# EAGLE design VNP (EAGLE 9.6.2)
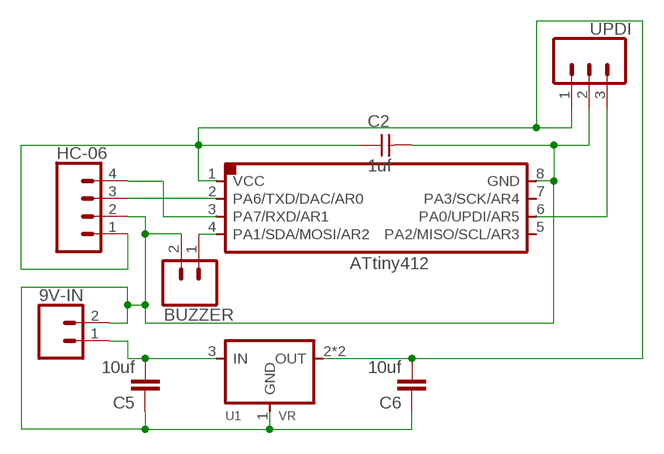
[diagram p0: schematic, sheet 1]

## Parts
9V-IN  CONN_02PTH3  [1X02_LONGPADS]
BUZZER  CONN_02LOCK_LONGPADS  [1X02_LOCK_LONGPADS]
C2  1uf  CAP_UNPOLARIZED  [C1206]
C5  10uf  CAP1206  [1206]
C6  10uf  CAP1206  [1206]
HC-06  CONN_04POLAR  [MOLEX-1X4]
U1  VR  VR_REGULATOR_SOT223  [SOT223]
U$1  UC_ATTINY412SI  [SOIC8]
UPDI  CONN_03SMD_RA_MALE  [1X03_SMD_RA_MALE]

## Nets
5V: C2.1 C6.2 HC-06.1 U1.2(OUT) U1.4(OUT) U$1.1(VCC) UPDI.1
BUZZER: BUZZER.1 U$1.4(PA1/SDA/MOSI/AR2)
GND: 9V-IN.2 BUZZER.2 C2.2 C5.1 C6.1 HC-06.2 U1.1(GND) U$1.8(GND) UPDI.2
RX: HC-06.4 U$1.3(PA7/RXD/AR1)
TX: HC-06.3 U$1.2(PA6/TXD/DAC/AR0)
UPDI: U$1.6(PA0/UPDI/AR5) UPDI.3
VCC [vcc]: 9V-IN.1 C5.2 U1.3(IN)
Unconnected: U$1.5(PA2/MISO/SCL/AR3) U$1.7(PA3/SCK/AR4)

## Library data of the parts
9V-IN BUZZER = SparkFun-Connectors:CONN_02: Multi connection point. Often used as Generic Header-pin footprint for 0.1 inch spaced/style header connections On any of the 0.1 inch spaced packages, you can populate with these: Break Away Headers - Straight <https://www.sparkfun.com/products/116> (PRT-00116) Break Away Male Headers - Right Angle <https://www.sparkfun.com/products/553> (PRT-00553) Female Headers <https://www.sparkfun.com/products/115> (PRT-00115) Break Away Headers - Machine Pin <https://www.sparkfun.com/products/117> (PRT-00117) Break Away Female Headers - Swiss Machine Pin <https://www.sparkfun.com/products/743> (PRT-00743) For SCREWTERMINALS and SPRING TERMINALS visit here: Screw Terimnals on SparkFun.com <https://www.sparkfun.com/search/results?term=Screw+Terminals> (5mm/3.5mm/2.54mm spacing) This device is also useful as a general connection point to wire up your design to another part of your project. Our various solder wires solder well into these plated through hole pads. Hook-Up Wire - Assortment (Stranded, 22 AWG) <https://www.sparkfun.com/products/11375> (PRT-11375) Hook-Up Wire - Assortment (Solid Core, 22 AWG) <https://www.sparkfun.com/products/11367> (PRT-11367) View the entire wire category on our website here <https://www.sparkfun.com/categories/141> Special notes: Molex polarized connector foot print use with: PRT-08233 with associated crimp pins and housings. 2.54_SCREWTERM for use with PRT-10571. 3.5mm Screw Terminal footprints for PRT-08084 5mm Screw Terminal footprints for use with PRT-08432
C2 = eagle_fab:CAP_UNPOLARIZED
C5 C6 = 01_SparkFun:CAP: Capacitor Standard 0603 ceramic capacitor, and 0.1" leaded capacitor.
HC-06 = SparkFun-Connectors:CONN_04: Multi connection point. Often used as Generic Header-pin footprint for 0.1 inch spaced/style header connections On any of the 0.1 inch spaced packages, you can populate with these: Break Away Headers - Straight <https://www.sparkfun.com/products/116> (PRT-00116) Break Away Male Headers - Right Angle <https://www.sparkfun.com/products/553> (PRT-00553) Female Headers <https://www.sparkfun.com/products/115> (PRT-00115) Break Away Headers - Machine Pin <https://www.sparkfun.com/products/117> (PRT-00117) Break Away Female Headers - Swiss Machine Pin <https://www.sparkfun.com/products/743> (PRT-00743) For SCREWTERMINALS and SPRING TERMINALS visit here: Screw Terimnals on SparkFun.com <https://www.sparkfun.com/search/results?term=Screw+Terminals> (5mm/3.5mm/2.54mm spacing) This device is also useful as a general connection point to wire up your design to another part of your project. Our various solder wires solder well into these plated through hole pads. Hook-Up Wire - Assortment (Stranded, 22 AWG) <https://www.sparkfun.com/products/11375> (PRT-11375) Hook-Up Wire - Assortment (Solid Core, 22 AWG) <https://www.sparkfun.com/products/11367> (PRT-11367) View the entire wire category on our website here <https://www.sparkfun.com/categories/141> Special notes: Molex polarized connector foot print use with SKU : PRT-08231 with associated crimp pins and housings. 1MM SMD Version SKU: PRT-10208; PROD_ID: CONN-08186; SF_ID: PRT-08231
U1 = eagle_fab:VR_REGULATOR_SOT223
U$1 = fab_new:UC_ATTINY412
UPDI = SparkFun-Connectors:CONN_03: Multi connection point. Often used as Generic Header-pin footprint for 0.1 inch spaced/style header connections On any of the 0.1 inch spaced packages, you can populate with these: Break Away Headers - Straight <https://www.sparkfun.com/products/116> (PRT-00116) Break Away Male Headers - Right Angle <https://www.sparkfun.com/products/553> (PRT-00553) Female Headers <https://www.sparkfun.com/products/115> (PRT-00115) Break Away Headers - Machine Pin <https://www.sparkfun.com/products/117> (PRT-00117) Break Away Female Headers - Swiss Machine Pin <https://www.sparkfun.com/products/743> (PRT-00743) Stackable Header - 3 Pin (Female, 0.1") <https://www.sparkfun.com/products/13875> (PRT-13875) For SCREWTERMINALS and SPRING TERMINALS visit here: Screw Terimnals on SparkFun.com <https://www.sparkfun.com/search/results?term=Screw+Terminals> (5mm/3.5mm/2.54mm spacing) This device is also useful as a general connection point to wire up your design to another part of your project. Our various solder wires solder well into these plated through hole pads. Hook-Up Wire - Assortment (Stranded, 22 AWG) <https://www.sparkfun.com/products/11375> (PRT-11375) Hook-Up Wire - Assortment (Solid Core, 22 AWG) <https://www.sparkfun.com/products/11367> (PRT-11367) View the entire wire category on our website here <https://www.sparkfun.com/categories/141> Special notes: Molex polarized connector foot print use with SKU : PRT-08232 with associated crimp pins and housings.; PROD_ID: CONN-10925

## Net classes
0 default: width 0.457 mm
2 vcc: width 0.559 mm

## Board
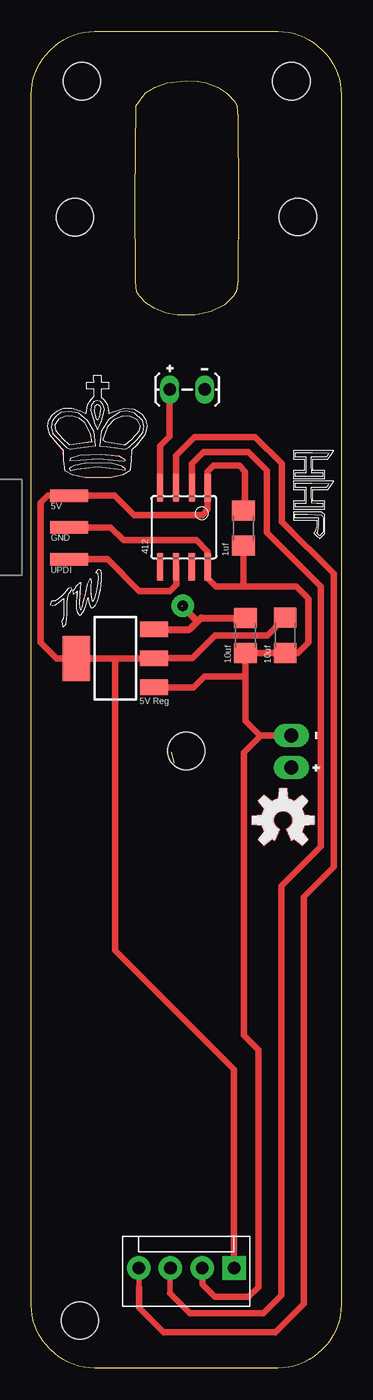
[diagram p1: board, top side]
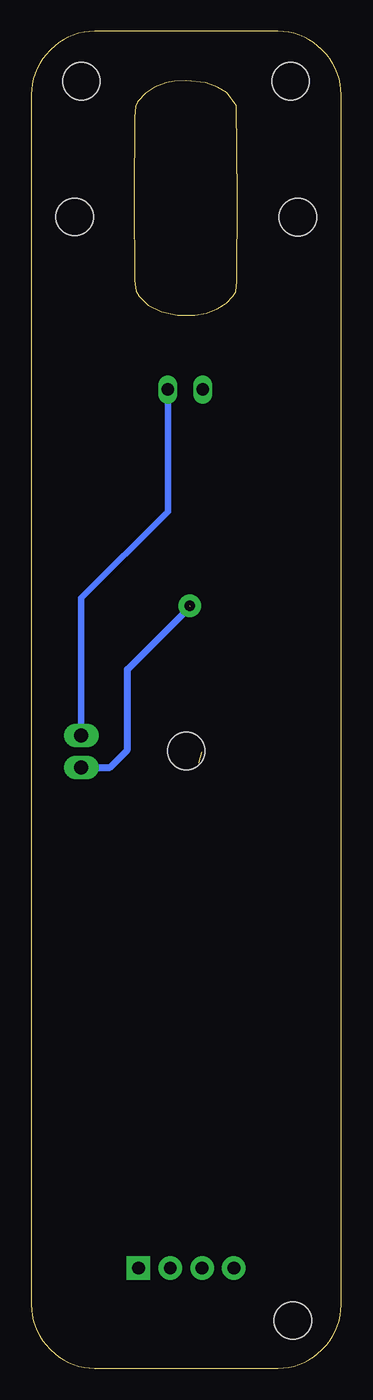
[diagram p2: board, bottom side, seen from below]

Size 24.76 x 106.68 mm. Coordinates in mm from the lower left corner, seen from the top.
Outline: 11.15,49.18 11.4,48.3
Outline: 11.7,84.02 10.75,84.21 9.88,84.55 9.15,85.01 8.63,85.55 8.42,85.91 8.31,86.76 8.29,93.5 8.37,100.76 9.14,101.76 9.89,102.22 10.83,102.57 12.39,102.74 13.33,102.72 13.96,102.58 14.92,102.21 15.65,101.76 16.26,101.06 16.43,100.69 16.52,99.82 16.56,93.34 16.52,86.78 16.4,85.95 16.16,85.56 15.41,84.84 14.35,84.31 13.07,84.03 11.7,84.02
Outline: 11.7,84.02 11.7,84.02
Outline: 23.22,105.22 23.29,105.14 arc-45 24.76,101.61 24.76,5.07 arc-45 23.29,1.54 23.22,1.46 arc-45 19.69,0 5.07,0 arc-45 1.54,1.46 1.46,1.54 arc-45 0,5.07 0,101.61 arc-45 1.46,105.14 1.54,105.22 arc-45 5.07,106.68 19.69,106.68 arc-45 23.22,105.22
Outline: 4.23,93.15 4.23,93.15
Copper layers (1*16): Top 0.035mm / dielectric 1.5mm / Bottom 0.035mm
Design rules "OthermillDRC_30_deg_v2": minimum track width 6mil, minimum drill 0.8mm, track to track 6mil, track to pad 6mil, pad to pad 6mil, via to via 6mil, smd to smd 0mil, copper to edge 0mil, drill to drill 6mil, minimum pad ring 10mil, minimum via ring 10mil, stop-mask expansion 1mil, vias tented up to drill 30mil, thermal gap 6mil
Holes 3 mm at 3.88,3.8 4.05,102.71 20.76,102.71 12.38,49.25 3.48,91.85 21.3,91.87

### Footprints (pad centres in the part's own frame; a part is rotated, then mirrored left to right if it is on the bottom)
1X02_LONGPADS = drill 1.118 pad 1.88 long: 1 0,0; 2 2.54,0
1X02_LOCK_LONGPADS = drill 1.016 long: 1 -0.127,0; 2 2.667,0
C1206 = smd 1.6 x 1.8: 1 -1.4,0; 2 1.4,0
1206 = smd 1.6 x 1.8: 1 -1.4,0; 2 1.4,0
MOLEX-1X4 = drill 1.016 pad 1.88 square: 1 0,0 | drill 1.016 pad 1.88: 2 2.54,0; 3 5.08,0; 4 7.62,0
SOT223 = smd 1.219 x 2.235: 1 -2.311,-3.099; 2 0,-3.099; 3 2.311,-3.099 | smd 3.6 x 2.2: 4 0,3.099
SOIC8 = smd 0.5 x 2.2: 1 -1.905,-3.154; 2 -0.645,-3.154; 3 0.625,-3.154; 4 1.895,-3.154; 5 1.905,3.154; 6 0.635,3.154; 7 -0.635,3.154; 8 -1.905,3.154
1X03_SMD_RA_MALE = smd 1 x 3: 1 -2.54,5; 2 0,5; 3 2.54,5

### Placement (x,y rotation side)
9V-IN  20.76,47.94 90 top
BUZZER  11.19,78.1 0 top
C2  16.95,67.04 270 top
C5  17.1,58.47 90 top
C6  20.27,58.49 90 top
HC-06  16.2,8 180 top
U1  6.7,56.64 90 top
U$1  12.19,67.1 180 top
U$2  [OSHW-LOGO-M_COPPER]  20.11,43.72 0 top
U$3  [OSHW-LOGO-M]  20.12,43.72 0 top
UPDI  -1.98,67.09 270 top

### Tracks (layer width: path | path; a pad name or v marks a point on that pad's centre or on a via)
5V
  Top 0.508: 6.71,56.64 4.35,56.64 2.02,56.64 0.76,57.9 0.76,69.08 1.31,69.62 UPDI.1 | 6.71,56.64 U1.2 9.83,56.67 12.88,56.67 14.67,58.46 18.85,58.46 C6.2 | C2.1 17.08,68.57 17.08,71.56 16.61,72.03 14.56,72.03 14.09,71.56 U$1.1 14.09,68.51 13.67,68.09 8.21,68.09 6.67,69.63 UPDI.1 | UPDI.1 3.03,69.64 | HC-06.1 16.2,23.83 6.71,33.32 6.71,56.64
  Top 0.559: U1.4 4.35,56.64
BUZZER
  Top 0.508: 10.26,70.28 U$1.4 10.28,73.57 11.06,74.35 BUZZER.1
GND
  Top 0.508: 9V-IN.2 18.27,50.48 | 17.11,55.2 17.11,51.64 18.27,50.48 | 17.11,55.2 C5.1 20.25,57.07 C6.1 20.3,57.06 21.3,57.06 22.14,57.9 22.14,61.42 21.17,62.38 16.95,62.38 | 18.27,50.48 18.3,50.45 16.99,49.15 16.99,26.57 18.14,25.42 18.14,6.47 17.36,5.69 14.66,5.69 13.66,6.69 HC-06.2 | 16.95,62.38 14.77,62.38 14.09,63.06 14.09,63.13 14.09,65.17 13.2,66.07 7.37,66.07 6.34,67.09 UPDI.2 | 16.95,62.38 C2.2 | U1.1 12.97,54.33 13.83,55.2 17.11,55.2
  Top 0.559: U$1.8 14.09,63.13
  Bottom 0.508: BUZZER.2 13.85,68.36 20.76,61.45 9V-IN.2
N$1
  Top 0.001: 22.82,67.68 22.82,67.3 22.69,66.78 22.56,66.65 22.78,66.43 23.03,66.21 23.26,66.4 23.45,66.6 23.45,68.11 23.32,68.22 23.18,68.32 20.95,68.32 20.95,67.68 22.82,67.68
N$2
  Top 0.001: 22.11,68.16 23.22,68.09 23.33,67.85 23.33,67.35 23.33,66.71 23.18,66.56 23.03,66.41 22.92,66.53 22.8,66.65 22.89,66.74 22.97,67.34 22.97,67.84 21.07,67.84 21.07,68.16 22.11,68.16
N$3
  Top 0.001: 23.45,68.56 23.45,69.2 22.5,69.2 22.5,70.11 23.67,70.11 23.83,70.32 24.08,70.66 24.18,70.79 20.95,70.79 20.95,70.11 21.82,70.11 21.82,69.2 20.95,69.2 20.95,68.56 23.45,68.56
N$4
  Top 0.001: 21.98,69.04 21.98,70.27 21.11,70.27 21.11,70.63 22.44,70.63 23.77,70.61 23.67,70.43 23.56,70.27 22.33,70.27 22.35,69.66 22.36,69.06 22.82,69.04 23.29,69.03 23.29,68.72 21.11,68.72 21.11,69.04 21.98,69.04
N$5
  Top 0.001: 23.45,70.98 23.45,71.62 22.5,71.62 22.5,72.53 23.08,72.53 23.67,72.54 23.92,72.87 24.17,73.21 20.95,73.21 20.95,72.53 21.82,72.53 21.82,71.62 20.95,71.62 20.95,70.98 23.45,70.98
N$6  (via drill 0.85 pad 1.8)
  other vias: 12.1,60.83
N$7
  Top 0.01: 2.59,60.73 2.59,60.61 2.57,60.18 2.54,59.75 2.5,59.74 2.41,59.6 2.51,59.18 2.58,59.16 2.77,59.39 2.83,59.79 2.85,60.2 2.86,60.6 2.87,60.86
N$8
  Top 0.001: 21.98,71.46 21.98,72.69 21.11,72.69 21.11,73.05 22.44,73.05 23.77,73.03 23.67,72.85 23.56,72.69 22.33,72.69 22.35,72.09 22.36,71.48 22.82,71.47 23.29,71.46 23.29,71.14 21.11,71.14 21.11,71.46 21.98,71.46
N$9
  Top 0.01: 2.59,60.73 2.6,61.01 2.59,61.42 2.44,61.29 2.19,61.08 1.91,60.91 1.7,60.84 1.53,60.94 1.57,61.16 1.69,61.2 1.9,61.23 2.18,61.4 2.44,61.6 2.64,61.8 2.8,62.03 2.94,62.23 3.18,62.31 3.25,62.15 3.03,61.84 2.89,61.45 2.87,61.03 2.87,60.86
N$10
  Top 0.01: 5.52,62.1 5.52,62.06 5.42,61.63 5.28,61.2 5.15,60.91 4.94,60.68 4.8,60.66 4.7,60.78 4.59,61.13 4.54,61.5 4.49,61.39 4.38,60.91 4.23,60.45 3.93,60.09 3.84,60.1 3.65,60.33 3.59,60.63 3.58,61.05 3.59,61.2
N$11
  Top 0.01: 3.88,61.33 3.89,61.43 3.92,61.88 3.96,62.26 3.98,62.65 3.89,62.71 3.55,62.38 3.45,62.19 3.31,62.03 3.34,61.79 3.61,61.94 3.66,62.01 3.64,61.74 3.61,61.47 3.59,61.2
N$12
  Top 0.01: 5.19,61.94 5.15,61.77 5.03,61.36 4.9,61.16 4.81,61.56 4.8,61.76 | 4.22,61.49 | 4.8,61.76 4.79,61.96 4.79,62.37 4.8,62.78 4.78,62.98 4.65,62.96 4.47,62.58 4.37,62.17 4.29,61.78 4.22,61.49 | 4.8,61.76 | 4.22,61.49 4.2,61.41 4.11,61.04 4.06,60.83 3.93,60.51 3.87,60.99 3.88,61.33
N$13
  Top 0.01: 5.34,63.74 5.14,63.51 5.16,63.47 5.23,63.48 5.28,63.44 5.32,63.04 5.3,62.61 5.24,62.19 5.19,61.94 | 5.52,62.1 5.59,62.5 5.63,62.94 5.63,63.39 5.56,63.65
  Top 0.025: 5.56,63.65 5.34,63.74
N$14
  Top 0.001: 4.24,71.06 3.32,71.27 2.71,71.58 2.59,72.46 2.56,73.24 2.12,73.69 1.48,74.49 1.3,75.17 1.4,75.64 1.67,76.06 2.07,76.39 2.56,76.6 3.26,76.62 3.99,76.38 4.39,76.18 4.42,76.39 4.5,76.89 4.77,77.31 5,77.56 5,78.11 4.42,78.11 4.42,78.69 5.01,78.69 4.99,78.97 4.98,79.24 5.28,79.24 5.58,79.24 5.58,78.69 6.17,78.69 6.17,78.11 5.58,78.11 5.58,77.51 5.8,77.3 6.05,76.94 6.15,76.45 6.18,76.17 6.43,76.31 7.47,76.63 8.22,76.53 8.83,76.14 9.14,75.71 9.26,75.22 9.09,74.49 8.39,73.64 8,73.25 7.98,72.48 7.9,71.61 7.28,71.28 6.25,71.05 4.24,71.06 | 4.24,71.06
N$15
  Top 0.001: 3.61,71.75 5.29,71.94 6.97,71.75 7.49,71.65 7.52,71.77 7.23,72 6.47,72.17 4.43,72.21 3.47,72.04 3.04,71.81 3.12,71.63 3.61,71.75 | 3.61,71.75
N$16
  Top 0.001: 3.86,72.48 5.38,72.6 6.97,72.44 7.42,72.38 7.52,72.48 7.07,72.76 5.58,72.89 3.88,72.83 3.11,72.59 3.06,72.43 3.86,72.48
N$17
  Top 0.001: 3.62,73.41 4.55,73.53 5.13,73.61 5,74.76 4.51,75.61 3.77,76.2 3.02,76.35 2.35,76.24 1.94,75.95 1.66,75.58 1.59,75.1 1.7,74.6 2.81,73.46 3.1,73.35 3.62,73.41
N$18
  Top 0.001: 2.54,74.13 1.98,74.78 1.92,75.3 2.22,75.76 2.67,75.99 3.22,76.01 3.76,75.84 4.22,75.5 4.7,74.56 4.81,73.92 3.36,73.71 3.05,73.65 2.54,74.13
N$19
  Top 0.001: 7.82,73.51 8.44,74.08 8.92,74.72 8.99,75.18 8.9,75.61 8.24,76.23 7.66,76.36 7.03,76.3 6.16,75.71 5.56,74.72 5.46,73.6 6.04,73.53 6.93,73.42 7.49,73.35 7.82,73.51 | 7.82,73.51
N$20
  Top 0.001: 7.37,73.67 5.94,73.9 5.74,74.05 6.14,75.17 6.63,75.73 7.31,76.01 7.91,75.98 8.39,75.75 8.67,75.19 8.57,74.74 8.02,74.11 7.47,73.65 7.37,73.67
N$21
  Top 0.001: 5.61,75.56 5.84,76.54 5.74,76.91 5.53,77.14 5.27,77.22 5,77.11 4.79,76.83 4.73,76.41 5.11,75.26 5.28,74.92 5.36,75.05 5.61,75.56
N$22
  Top 0.001: 5.22,75.76 5.04,76.33 5.11,76.83 5.3,76.93 5.46,76.83 5.53,76.58 5.42,75.89 5.3,75.67 5.22,75.76
RX
  Top 0.457: 8.6,6.44 8.6,7.97 HC-06.4
  Top 0.508: U$1.3 11.56,72.83 13.05,74.32 17.88,74.32 20.02,72.18 20.02,67.53 24.15,63.41 24.15,39.99 21.76,37.61 21.76,5.14 19.49,2.87 10.55,2.87 8.6,4.82 8.6,6.44
TX
  Top 0.457: 11.09,5.98 11.09,7.97 HC-06.3
  Top 0.508: U$1.2 12.83,72.2 13.75,73.12 17.33,73.12 18.83,71.62 18.83,66.68 23.15,62.37 23.15,41.65 19.97,38.47 19.97,5.83 18.53,4.39 12.67,4.39 11.09,5.98
UPDI
  Top 0.508: UPDI.3 6.08,64.55 8.6,62.03 11.07,62.03 11.58,62.55 11.58,63.91 U$1.6
VCC  (1 unrouted)
  Top 0.559: U1.3 12.65,58.96 13.27,59.58 | C5.2 13.56,59.87 13.27,59.58 | 13.27,59.58 12.08,60.78 12.08,60.85
  Bottom 0.559: 9V-IN.1 18.47,47.94 17.08,49.33 17.08,55.76 12.04,60.79

### Text on the board
tNames: - | - | - | 5V | GND | 412 | 1uf | UPDI | 10uf | 10uf | 5V Reg | - | - | -